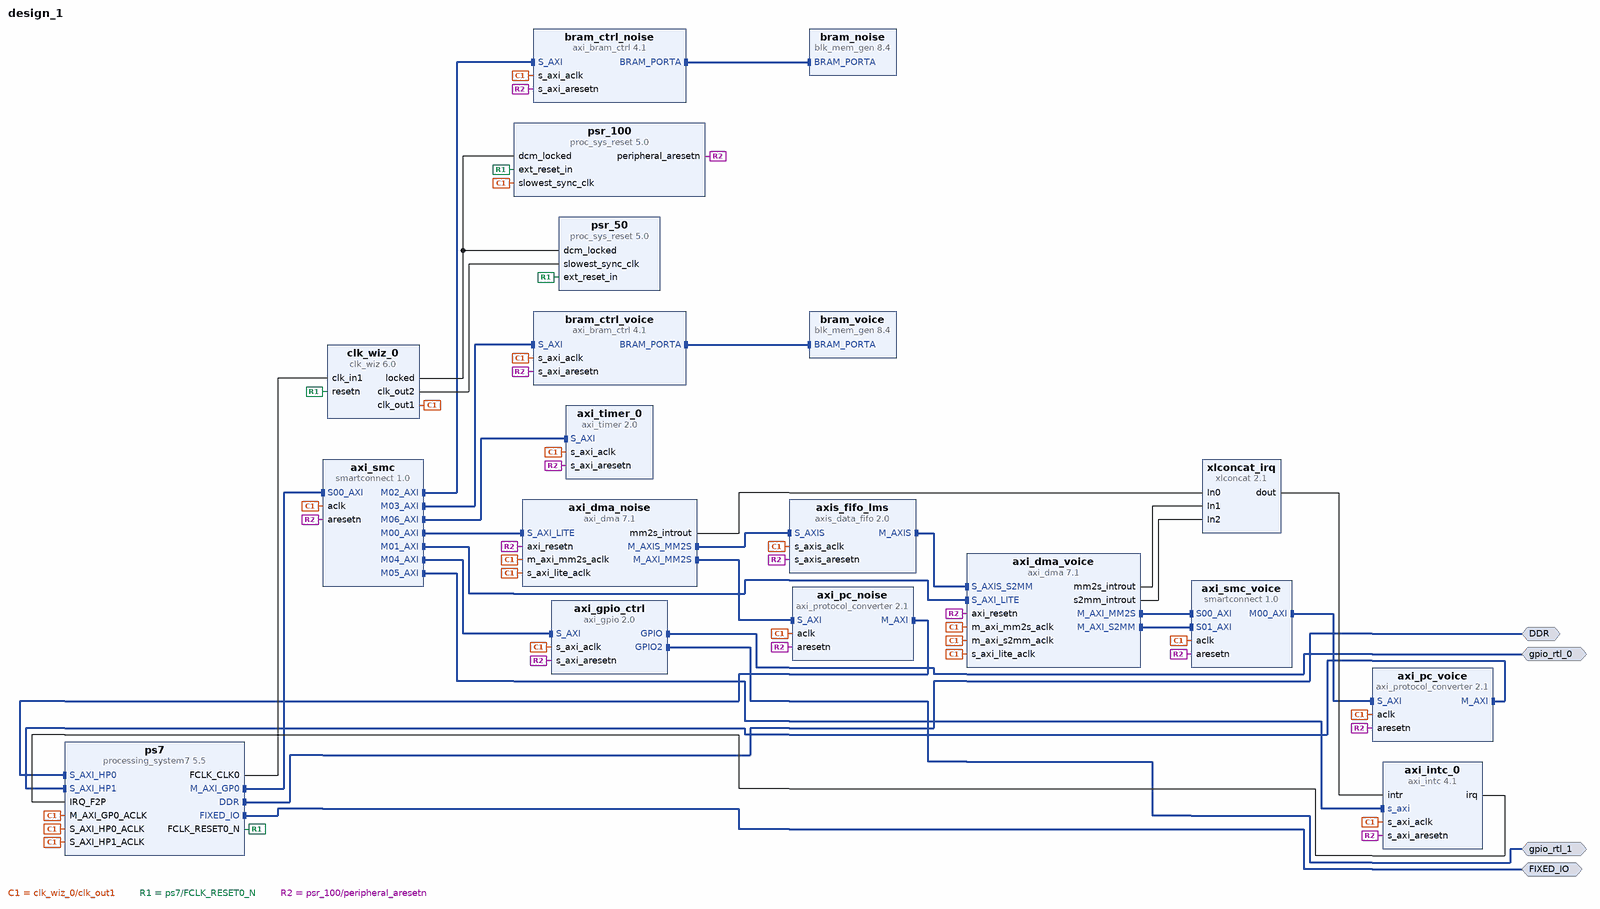
[diagram p0: block diagram of the top level]
# Vivado block design design_1, xc7z020clg400-1, Vivado 2025.1
create_bd_design design_1

create_bd_intf_port -mode Master -vlnv xilinx.com:interface:ddrx_rtl:1.0 DDR
create_bd_intf_port -mode Master -vlnv xilinx.com:display_processing_system7:fixedio_rtl:1.0 FIXED_IO
create_bd_intf_port -mode Master -vlnv xilinx.com:interface:gpio_rtl:1.0 gpio_rtl_0
create_bd_intf_port -mode Master -vlnv xilinx.com:interface:gpio_rtl:1.0 gpio_rtl_1

create_bd_cell -type ip -vlnv xilinx.com:ip:processing_system7:5.5 ps7
set_property -dict [list \
  CONFIG.PCW_FPGA0_PERIPHERAL_FREQMHZ 100 \
  CONFIG.PCW_IRQ_F2P_INTR 1 \
  CONFIG.PCW_TTC0_PERIPHERAL_ENABLE 1 \
  CONFIG.PCW_TTC0_TTC0_IO EMIO \
  CONFIG.PCW_UART0_PERIPHERAL_ENABLE 1 \
  CONFIG.PCW_UART0_UART0_IO EMIO \
  CONFIG.PCW_UART_PERIPHERAL_FREQMHZ 100 \
  CONFIG.PCW_USE_FABRIC_INTERRUPT 1 \
  CONFIG.PCW_USE_S_AXI_HP0 1 \
  CONFIG.PCW_USE_S_AXI_HP1 1 \
] [get_bd_cells ps7]
# 40 more settings of ps7 are not shown: defaults, MIO pin electricals, DDR timing, and values the tool derives
create_bd_cell -type ip -vlnv xilinx.com:ip:clk_wiz:6.0 clk_wiz_0
set_property -dict [list \
  CONFIG.CLKOUT1_REQUESTED_OUT_FREQ 100.000 \
  CONFIG.CLKOUT2_REQUESTED_OUT_FREQ 50.000 \
  CONFIG.CLKOUT2_USED true \
  CONFIG.NUM_OUT_CLKS 2 \
  CONFIG.PRIM_IN_FREQ 100.000 \
  CONFIG.RESET_TYPE ACTIVE_LOW \
  CONFIG.USE_RESET true \
] [get_bd_cells clk_wiz_0]
create_bd_cell -type ip -vlnv xilinx.com:ip:proc_sys_reset:5.0 psr_100
create_bd_cell -type ip -vlnv xilinx.com:ip:proc_sys_reset:5.0 psr_50
create_bd_cell -type ip -vlnv xilinx.com:ip:smartconnect:1.0 axi_smc
set_property -dict {CONFIG.NUM_MI 7 CONFIG.NUM_SI 1} [get_bd_cells axi_smc]
create_bd_cell -type ip -vlnv xilinx.com:ip:axi_dma:7.1 axi_dma_noise
set_property -dict [list \
  CONFIG.c_include_s2mm 0 \
  CONFIG.c_include_sg 0 \
  CONFIG.c_m_axi_mm2s_data_width 64 \
  CONFIG.c_m_axis_mm2s_tdata_width 32 \
  CONFIG.c_mm2s_burst_size 8 \
] [get_bd_cells axi_dma_noise]
create_bd_cell -type ip -vlnv xilinx.com:ip:axi_dma:7.1 axi_dma_voice
set_property -dict [list \
  CONFIG.c_include_s2mm 1 \
  CONFIG.c_include_sg 0 \
  CONFIG.c_m_axi_mm2s_data_width 64 \
  CONFIG.c_m_axi_s2mm_data_width 64 \
  CONFIG.c_m_axis_mm2s_tdata_width 32 \
  CONFIG.c_mm2s_burst_size 8 \
  CONFIG.c_s2mm_burst_size 16 \
  CONFIG.c_s_axis_s2mm_tdata_width 32 \
] [get_bd_cells axi_dma_voice]
create_bd_cell -type ip -vlnv xilinx.com:ip:axi_bram_ctrl:4.1 bram_ctrl_noise
set_property -dict {CONFIG.SINGLE_PORT_BRAM 1} [get_bd_cells bram_ctrl_noise]
create_bd_cell -type ip -vlnv xilinx.com:ip:blk_mem_gen:8.4 bram_noise
set_property -dict {CONFIG.Memory_Type Single_Port_RAM CONFIG.Read_Width_A 32 CONFIG.Write_Width_A 32} [get_bd_cells bram_noise]
create_bd_cell -type ip -vlnv xilinx.com:ip:axi_bram_ctrl:4.1 bram_ctrl_voice
set_property -dict {CONFIG.SINGLE_PORT_BRAM 1} [get_bd_cells bram_ctrl_voice]
create_bd_cell -type ip -vlnv xilinx.com:ip:blk_mem_gen:8.4 bram_voice
set_property -dict {CONFIG.Memory_Type Single_Port_RAM CONFIG.Read_Width_A 32 CONFIG.Write_Width_A 32} [get_bd_cells bram_voice]
create_bd_cell -type ip -vlnv xilinx.com:ip:axi_gpio:2.0 axi_gpio_ctrl
set_property -dict [list \
  CONFIG.C_ALL_INPUTS_2 1 \
  CONFIG.C_GPIO2_WIDTH 8 \
  CONFIG.C_GPIO_WIDTH 8 \
  CONFIG.C_IS_DUAL 1 \
] [get_bd_cells axi_gpio_ctrl]
create_bd_cell -type ip -vlnv xilinx.com:ip:axi_timer:2.0 axi_timer_0
create_bd_cell -type ip -vlnv xilinx.com:ip:axi_intc:4.1 axi_intc_0
set_property -dict {CONFIG.C_HAS_FAST 0 CONFIG.C_IRQ_CONNECTION 0 CONFIG.C_IRQ_IS_LEVEL 1} [get_bd_cells axi_intc_0]
create_bd_cell -type ip -vlnv xilinx.com:ip:xlconcat:2.1 xlconcat_irq
set_property -dict {CONFIG.NUM_PORTS 3} [get_bd_cells xlconcat_irq]
create_bd_cell -type ip -vlnv xilinx.com:ip:axi_protocol_converter:2.1 axi_pc_noise
set_property -dict {CONFIG.DATA_WIDTH 64 CONFIG.MI_PROTOCOL AXI3 CONFIG.SI_PROTOCOL AXI4} [get_bd_cells axi_pc_noise]
create_bd_cell -type ip -vlnv xilinx.com:ip:smartconnect:1.0 axi_smc_voice
set_property -dict {CONFIG.NUM_MI 1 CONFIG.NUM_SI 2} [get_bd_cells axi_smc_voice]
create_bd_cell -type ip -vlnv xilinx.com:ip:axi_protocol_converter:2.1 axi_pc_voice
set_property -dict {CONFIG.DATA_WIDTH 64 CONFIG.MI_PROTOCOL AXI3 CONFIG.SI_PROTOCOL AXI4} [get_bd_cells axi_pc_voice]
create_bd_cell -type ip -vlnv xilinx.com:ip:axis_data_fifo:2.0 axis_fifo_lms
set_property -dict {CONFIG.FIFO_DEPTH 512 CONFIG.HAS_TLAST 1 CONFIG.TDATA_NUM_BYTES 4} [get_bd_cells axis_fifo_lms]

# ---- connections ----

connect_bd_intf_net [get_bd_intf_pins axi_dma_noise/M_AXIS_MM2S] [get_bd_intf_pins axis_fifo_lms/S_AXIS]
connect_bd_intf_net [get_bd_intf_pins axi_dma_noise/M_AXI_MM2S] [get_bd_intf_pins axi_pc_noise/S_AXI]
connect_bd_intf_net [get_bd_intf_pins axi_dma_voice/M_AXI_MM2S] [get_bd_intf_pins axi_smc_voice/S00_AXI]
connect_bd_intf_net [get_bd_intf_pins axi_dma_voice/M_AXI_S2MM] [get_bd_intf_pins axi_smc_voice/S01_AXI]
connect_bd_intf_net [get_bd_intf_ports gpio_rtl_0] [get_bd_intf_pins axi_gpio_ctrl/GPIO]
connect_bd_intf_net [get_bd_intf_ports gpio_rtl_1] [get_bd_intf_pins axi_gpio_ctrl/GPIO2]
connect_bd_intf_net [get_bd_intf_pins axi_pc_noise/M_AXI] [get_bd_intf_pins ps7/S_AXI_HP0]
connect_bd_intf_net [get_bd_intf_pins axi_pc_voice/M_AXI] [get_bd_intf_pins ps7/S_AXI_HP1]
connect_bd_intf_net [get_bd_intf_pins axi_smc/M00_AXI] [get_bd_intf_pins axi_dma_noise/S_AXI_LITE]
connect_bd_intf_net [get_bd_intf_pins axi_smc/M01_AXI] [get_bd_intf_pins axi_dma_voice/S_AXI_LITE]
connect_bd_intf_net [get_bd_intf_pins axi_smc/M02_AXI] [get_bd_intf_pins bram_ctrl_noise/S_AXI]
connect_bd_intf_net [get_bd_intf_pins axi_smc/M03_AXI] [get_bd_intf_pins bram_ctrl_voice/S_AXI]
connect_bd_intf_net [get_bd_intf_pins axi_smc/M04_AXI] [get_bd_intf_pins axi_gpio_ctrl/S_AXI]
connect_bd_intf_net [get_bd_intf_pins axi_smc/M05_AXI] [get_bd_intf_pins axi_intc_0/s_axi]
connect_bd_intf_net [get_bd_intf_pins axi_smc/M06_AXI] [get_bd_intf_pins axi_timer_0/S_AXI]
connect_bd_intf_net [get_bd_intf_pins axi_smc_voice/M00_AXI] [get_bd_intf_pins axi_pc_voice/S_AXI]
connect_bd_intf_net [get_bd_intf_pins axis_fifo_lms/M_AXIS] [get_bd_intf_pins axi_dma_voice/S_AXIS_S2MM]
connect_bd_intf_net [get_bd_intf_pins bram_ctrl_noise/BRAM_PORTA] [get_bd_intf_pins bram_noise/BRAM_PORTA]
connect_bd_intf_net [get_bd_intf_pins bram_ctrl_voice/BRAM_PORTA] [get_bd_intf_pins bram_voice/BRAM_PORTA]
connect_bd_intf_net [get_bd_intf_ports DDR] [get_bd_intf_pins ps7/DDR]
connect_bd_intf_net [get_bd_intf_ports FIXED_IO] [get_bd_intf_pins ps7/FIXED_IO]
connect_bd_intf_net [get_bd_intf_pins ps7/M_AXI_GP0] [get_bd_intf_pins axi_smc/S00_AXI]
connect_bd_net [get_bd_pins axi_dma_noise/mm2s_introut] [get_bd_pins xlconcat_irq/In0]
connect_bd_net [get_bd_pins axi_dma_voice/mm2s_introut] [get_bd_pins xlconcat_irq/In1]
connect_bd_net [get_bd_pins axi_dma_voice/s2mm_introut] [get_bd_pins xlconcat_irq/In2]
connect_bd_net [get_bd_pins axi_intc_0/irq] [get_bd_pins ps7/IRQ_F2P]
connect_bd_net [get_bd_pins clk_wiz_0/clk_out1] \
  [get_bd_pins psr_100/slowest_sync_clk] [get_bd_pins axi_smc/aclk] [get_bd_pins ps7/M_AXI_GP0_ACLK] \
  [get_bd_pins ps7/S_AXI_HP0_ACLK] [get_bd_pins ps7/S_AXI_HP1_ACLK] [get_bd_pins axi_dma_noise/s_axi_lite_aclk] \
  [get_bd_pins axi_dma_noise/m_axi_mm2s_aclk] [get_bd_pins axi_dma_voice/s_axi_lite_aclk] \
  [get_bd_pins axi_dma_voice/m_axi_mm2s_aclk] [get_bd_pins axi_dma_voice/m_axi_s2mm_aclk] \
  [get_bd_pins bram_ctrl_noise/s_axi_aclk] [get_bd_pins bram_ctrl_voice/s_axi_aclk] [get_bd_pins axi_gpio_ctrl/s_axi_aclk] \
  [get_bd_pins axi_timer_0/s_axi_aclk] [get_bd_pins axi_intc_0/s_axi_aclk] [get_bd_pins axi_pc_noise/aclk] \
  [get_bd_pins axi_smc_voice/aclk] [get_bd_pins axi_pc_voice/aclk] [get_bd_pins axis_fifo_lms/s_axis_aclk]
connect_bd_net [get_bd_pins clk_wiz_0/clk_out2] [get_bd_pins psr_50/slowest_sync_clk]
connect_bd_net [get_bd_pins clk_wiz_0/locked] [get_bd_pins psr_100/dcm_locked] [get_bd_pins psr_50/dcm_locked]
connect_bd_net [get_bd_pins ps7/FCLK_CLK0] [get_bd_pins clk_wiz_0/clk_in1]
connect_bd_net [get_bd_pins ps7/FCLK_RESET0_N] [get_bd_pins clk_wiz_0/resetn] [get_bd_pins psr_100/ext_reset_in] [get_bd_pins psr_50/ext_reset_in]
connect_bd_net [get_bd_pins psr_100/peripheral_aresetn] \
  [get_bd_pins axi_smc/aresetn] [get_bd_pins axi_dma_noise/axi_resetn] [get_bd_pins axi_dma_voice/axi_resetn] \
  [get_bd_pins bram_ctrl_noise/s_axi_aresetn] [get_bd_pins bram_ctrl_voice/s_axi_aresetn] \
  [get_bd_pins axi_gpio_ctrl/s_axi_aresetn] [get_bd_pins axi_timer_0/s_axi_aresetn] [get_bd_pins axi_intc_0/s_axi_aresetn] \
  [get_bd_pins axi_pc_noise/aresetn] [get_bd_pins axi_smc_voice/aresetn] [get_bd_pins axi_pc_voice/aresetn] \
  [get_bd_pins axis_fifo_lms/s_axis_aresetn]
connect_bd_net [get_bd_pins xlconcat_irq/dout] [get_bd_pins axi_intc_0/intr]
set_property HDL_ATTRIBUTE.BMM_INFO_PROCESSOR {arm > design_1 bram_ctrl_noise design_1 bram_ctrl_voice} [get_bd_cells ps7]
set_property HDL_ATTRIBUTE.KEEP_HIERARCHY yes [get_bd_cells ps7]
set_property HDL_ATTRIBUTE.BMM_INFO_ADDRESS_SPACE {byte  0x40000000 32 > design_1 bram_noise} [get_bd_cells bram_ctrl_noise]
set_property HDL_ATTRIBUTE.KEEP_HIERARCHY yes [get_bd_cells bram_ctrl_noise]
set_property HDL_ATTRIBUTE.BMM_INFO_ADDRESS_SPACE {byte  0x42000000 32 > design_1 bram_voice} [get_bd_cells bram_ctrl_voice]
set_property HDL_ATTRIBUTE.KEEP_HIERARCHY yes [get_bd_cells bram_ctrl_voice]

# ---- address map ----
assign_bd_address -offset 0x00000000 -range 512M -target_address_space [get_bd_addr_spaces axi_dma_noise/Data_MM2S] [get_bd_addr_segs ps7/S_AXI_HP0/HP0_DDR_LOWOCM]
assign_bd_address -offset 0x00000000 -range 512M -target_address_space [get_bd_addr_spaces axi_dma_voice/Data_MM2S] [get_bd_addr_segs ps7/S_AXI_HP1/HP1_DDR_LOWOCM]
assign_bd_address -offset 0x00000000 -range 512M -target_address_space [get_bd_addr_spaces axi_dma_voice/Data_S2MM] [get_bd_addr_segs ps7/S_AXI_HP1/HP1_DDR_LOWOCM]
assign_bd_address -offset 0x40000000 -range 8K -target_address_space [get_bd_addr_spaces ps7/Data] [get_bd_addr_segs bram_ctrl_noise/S_AXI/Mem0]
assign_bd_address -offset 0x40400000 -range 64K -target_address_space [get_bd_addr_spaces ps7/Data] [get_bd_addr_segs axi_dma_noise/S_AXI_LITE/Reg]
assign_bd_address -offset 0x40410000 -range 64K -target_address_space [get_bd_addr_spaces ps7/Data] [get_bd_addr_segs axi_dma_voice/S_AXI_LITE/Reg]
assign_bd_address -offset 0x41200000 -range 64K -target_address_space [get_bd_addr_spaces ps7/Data] [get_bd_addr_segs axi_gpio_ctrl/S_AXI/Reg]
assign_bd_address -offset 0x41800000 -range 64K -target_address_space [get_bd_addr_spaces ps7/Data] [get_bd_addr_segs axi_intc_0/S_AXI/Reg]
assign_bd_address -offset 0x42000000 -range 8K -target_address_space [get_bd_addr_spaces ps7/Data] [get_bd_addr_segs bram_ctrl_voice/S_AXI/Mem0]
assign_bd_address -offset 0x42800000 -range 64K -target_address_space [get_bd_addr_spaces ps7/Data] [get_bd_addr_segs axi_timer_0/S_AXI/Reg]

validate_bd_design
save_bd_design
